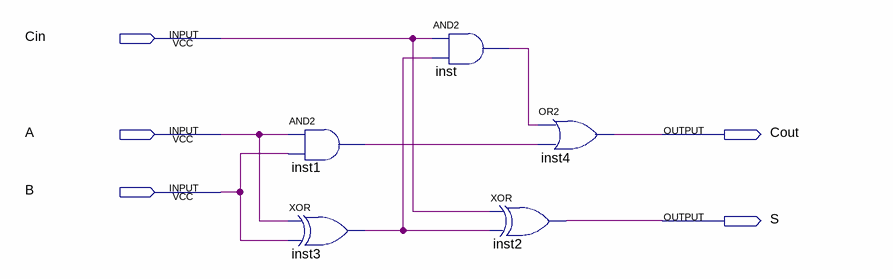
[diagram p0: schematic sheet]
// Quartus schematic Full_Adder.bdf as structural Verilog: 5 symbols, 5 pins
module Full_Adder (
  input  Cin,
  input  A,
  input  B,
  output Cout,
  output S
);

  wire inst1_out, inst3_out, inst_out;

  and inst1 (inst1_out, A, B);
  xor inst3 (inst3_out, A, B);
  and inst (inst_out, Cin, inst3_out);
  or inst4 (Cout, inst_out, inst1_out);
  xor inst2 (S, Cin, inst3_out);
endmodule
